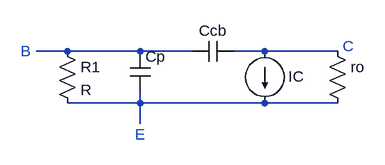
[diagram p0: schematic 6.asc]
6.asc, the LTspice schematic file:
Version 4
SHEET 1 880 680
WIRE 16 96 -32 96
WIRE 128 96 16 96
WIRE 208 96 128 96
WIRE 320 96 272 96
WIRE 432 96 320 96
WIRE 128 176 128 160
WIRE 128 176 16 176
WIRE 320 176 128 176
WIRE 432 176 320 176
WIRE 128 208 128 176
SYMBOL res 0 80 R0
SYMATTR InstName R1
SYMBOL res 416 80 R0
SYMATTR InstName ro
SYMATTR Value ""
SYMBOL cap 112 96 R0
SYMATTR InstName Cp
SYMATTR Value ""
SYMBOL cap 208 112 R270
WINDOW 0 32 32 VTop 2
WINDOW 3 0 32 VBottom 2
SYMATTR InstName Ccb
SYMATTR Value ""
SYMBOL current 320 96 R0
WINDOW 0 36 39 Left 2
SYMATTR InstName IC
SYMATTR Value ""
TEXT 120 224 Left 2 ;E
TEXT 440 88 Left 2 ;C
TEXT -56 96 Left 2 ;B

The netlist it stands for:
* 6.asc
R1 N001 N003 R
ro N002 N003
Cp N001 N003
Ccb N001 N002
IC N002 N003
* E
* C
* B
.backanno
.end